# EAGLE design Lab05 (EAGLE 9.6.2)
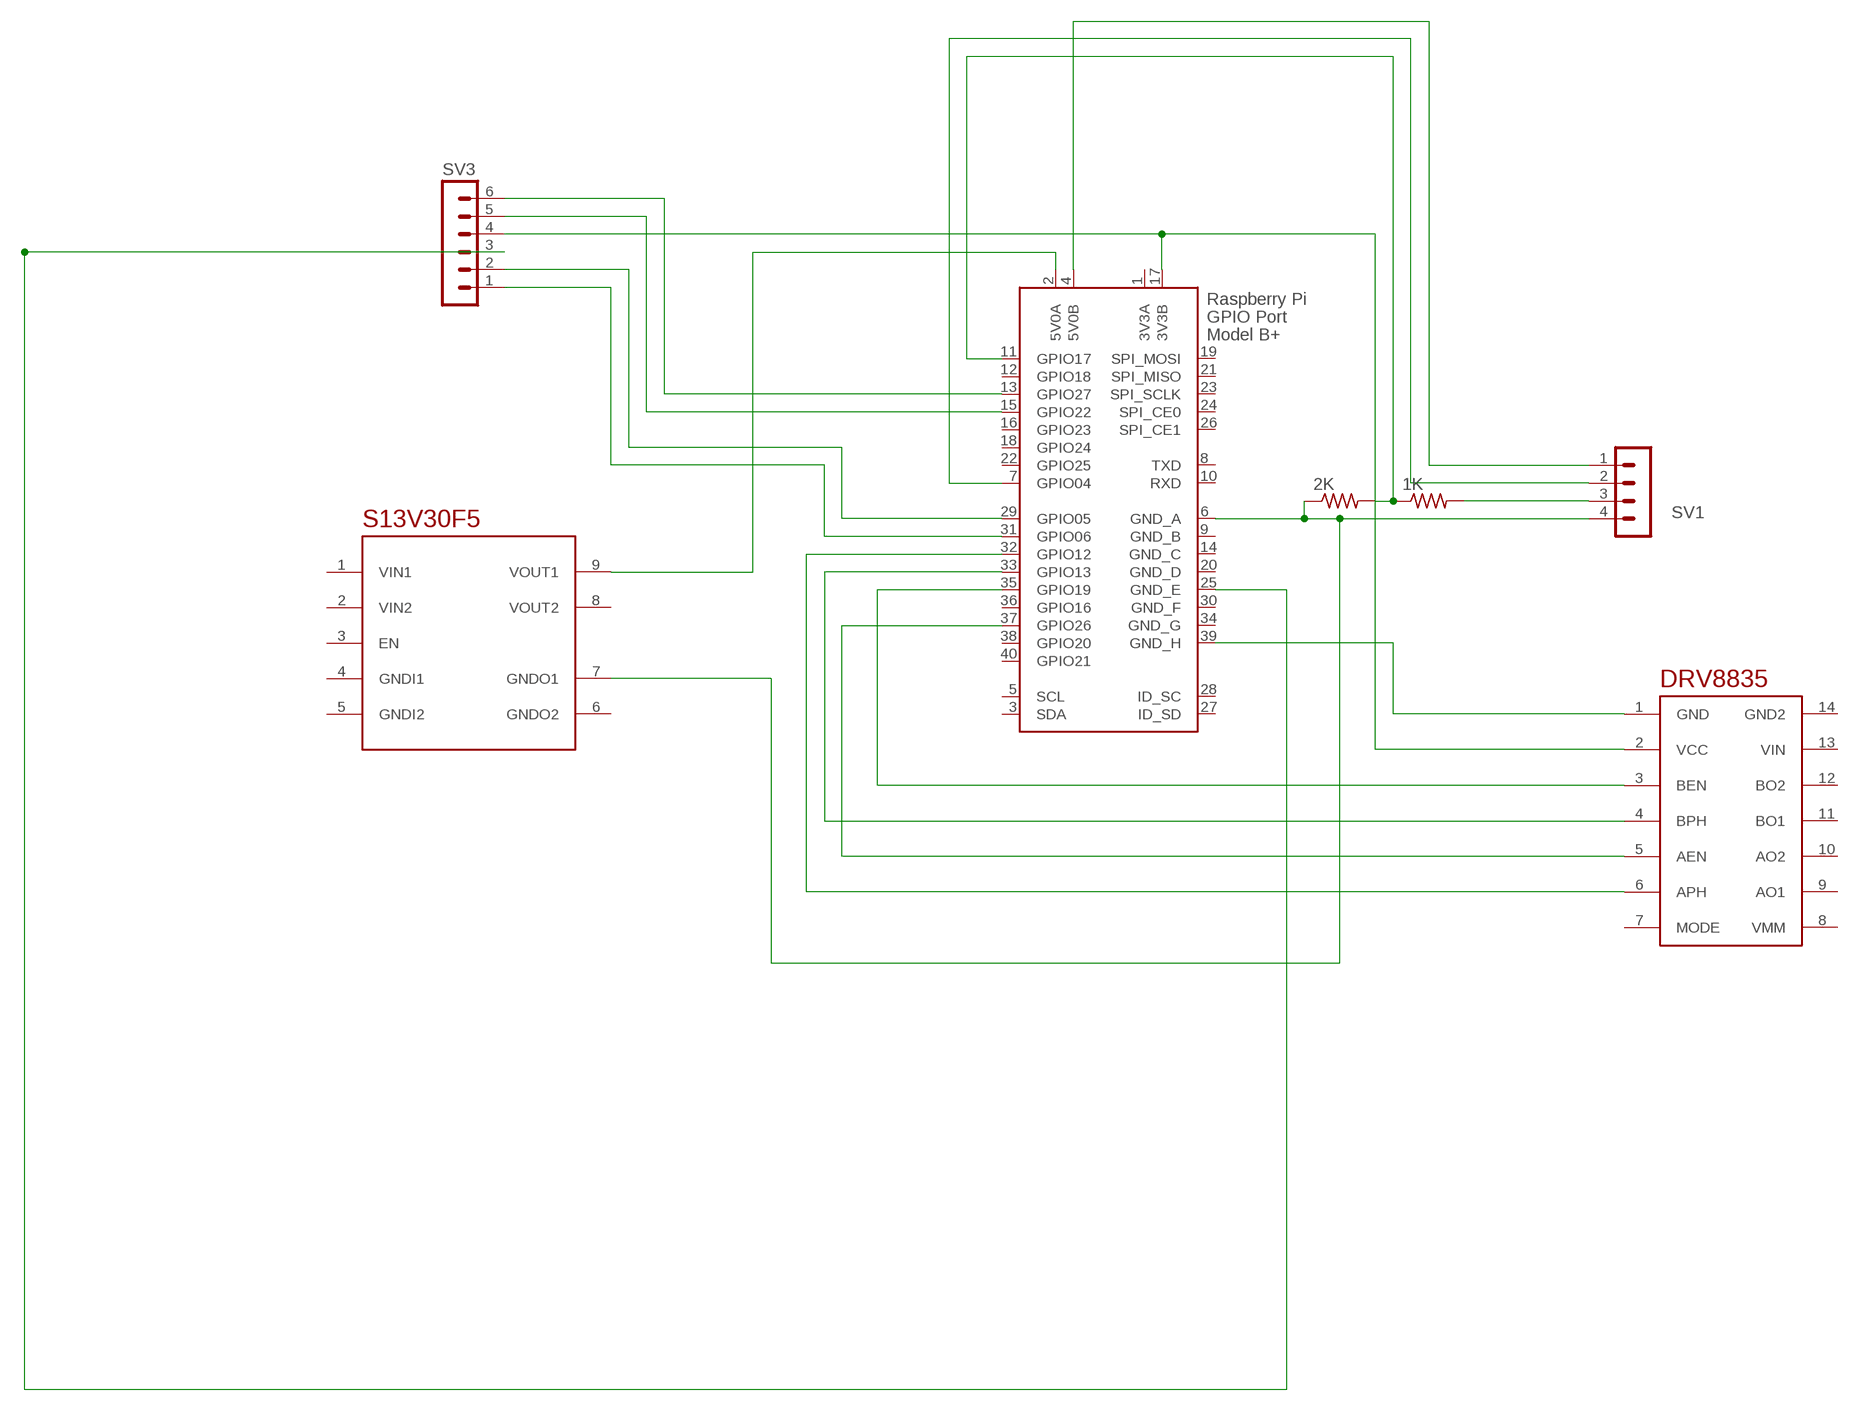
[diagram p0: schematic, sheet 1]

## Parts
1K  R-US_0207/10  [0207/10]
2K  R-US_0207/10  [0207/10]
SV1  MA04-1  [MA04-1]
SV3  MA06-1  [MA06-1]
U$1  DRV8835  [DRV8835]
U$2  S13V20F5  [S13V20F5]
X1  RASPI_BOARD_B+#_E4  [RASPI_BOARD_B+_EDGES_4DRILL]

## Nets
N$1: SV1.1 X1.4(5V0B)
N$2: SV1.2 X1.7(GPIO04)
N$3: 1K.2 SV1.3
N$4: 1K.1 2K.2 X1.11(GPIO17)
N$5: 2K.1 SV1.4 U$2.7(GNDO1) X1.6(GND_A)
N$6: SV3.4 U$1.2(VCC) X1.17(3V3B)
N$7: SV3.6 X1.13(GPIO27)
N$8: SV3.5 X1.15(GPIO22)
N$9: SV3.2 X1.29(GPIO05)
N$10: SV3.1 X1.31(GPIO06)
N$11: SV3.3 X1.25(GND_E)
N$12: U$1.4(BPH) X1.33(GPIO13)
N$13: U$1.6(APH) X1.32(GPIO12)
N$14: U$1.5(AEN) X1.37(GPIO26)
N$15: U$1.3(BEN) X1.35(GPIO19)
N$16: U$1.1(GND) X1.39(GND_H)
N$17: U$2.9(VOUT1) X1.2(5V0A)
Unconnected: U$1.7(MODE) U$1.8(VMM) U$1.9(AO1) U$1.10(AO2) U$1.11(BO1) U$1.12(BO2) U$1.13(VIN) U$1.14(GND2) U$2.1(VIN1) U$2.2(VIN2) U$2.3(EN) U$2.4(GNDI1) U$2.5(GNDI2) U$2.6(GNDO2) U$2.8(VOUT2) X1.3(SDA) X1.5(SCL) X1.8(TXD) X1.10(RXD) X1.12(GPIO18) X1.16(GPIO23) X1.18(GPIO24) X1.19(SPI_MOSI) X1.21(SPI_MISO) X1.22(GPIO25) X1.23(SPI_SCLK) X1.24(SPI_CE0) X1.26(SPI_CE1) X1.27(ID_SD) X1.28(ID_SC) X1.36(GPIO16) X1.38(GPIO20) X1.40(GPIO21)

## Power pins joined to a net without a drawn wire
3V3A: X1.1(3V3A)
GND_B: X1.9(GND_B)
GND_C: X1.14(GND_C)
GND_D: X1.20(GND_D)
GND_F: X1.30(GND_F)
GND_G: X1.34(GND_G)

## Library data of the parts
1K 2K = rcl:R-US_: RESISTOR, American symbol; SPICEPREFIX: R
SV1 = con-lstb:MA04-1: PIN HEADER; OC_FARNELL: unknown; OC_NEWARK: unknown
SV3 = con-lstb:MA06-1: PIN HEADER; OC_FARNELL: unknown; OC_NEWARK: unknown
U$1 = mt280_21:DRV8835
U$2 = mt280_21:S13V20F5
X1 = raspberrypi_bastelstube_v13:RASPI_BOARD_B+#: Raspberry Pi GPIO connector with markings for the outer dimensions of the Raspberry Pi board model B+ with different sets of drill holes or mounting pads All pins connected

## Board
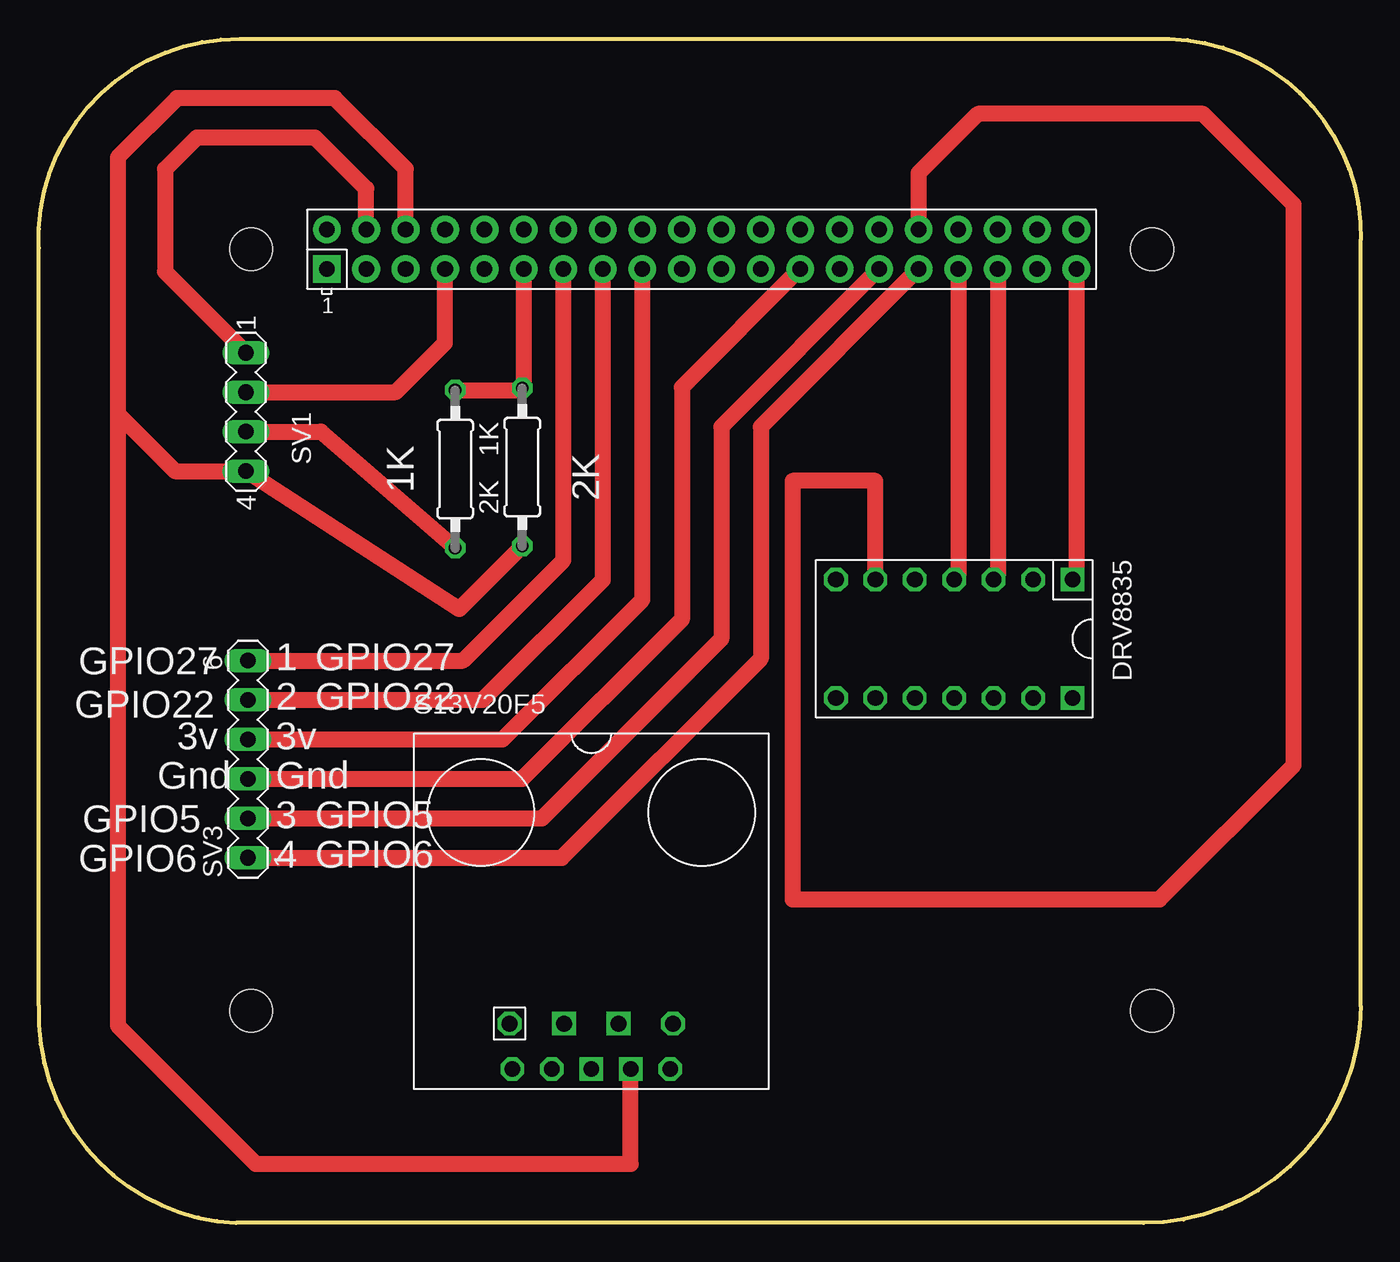
[diagram p1: board, top side]
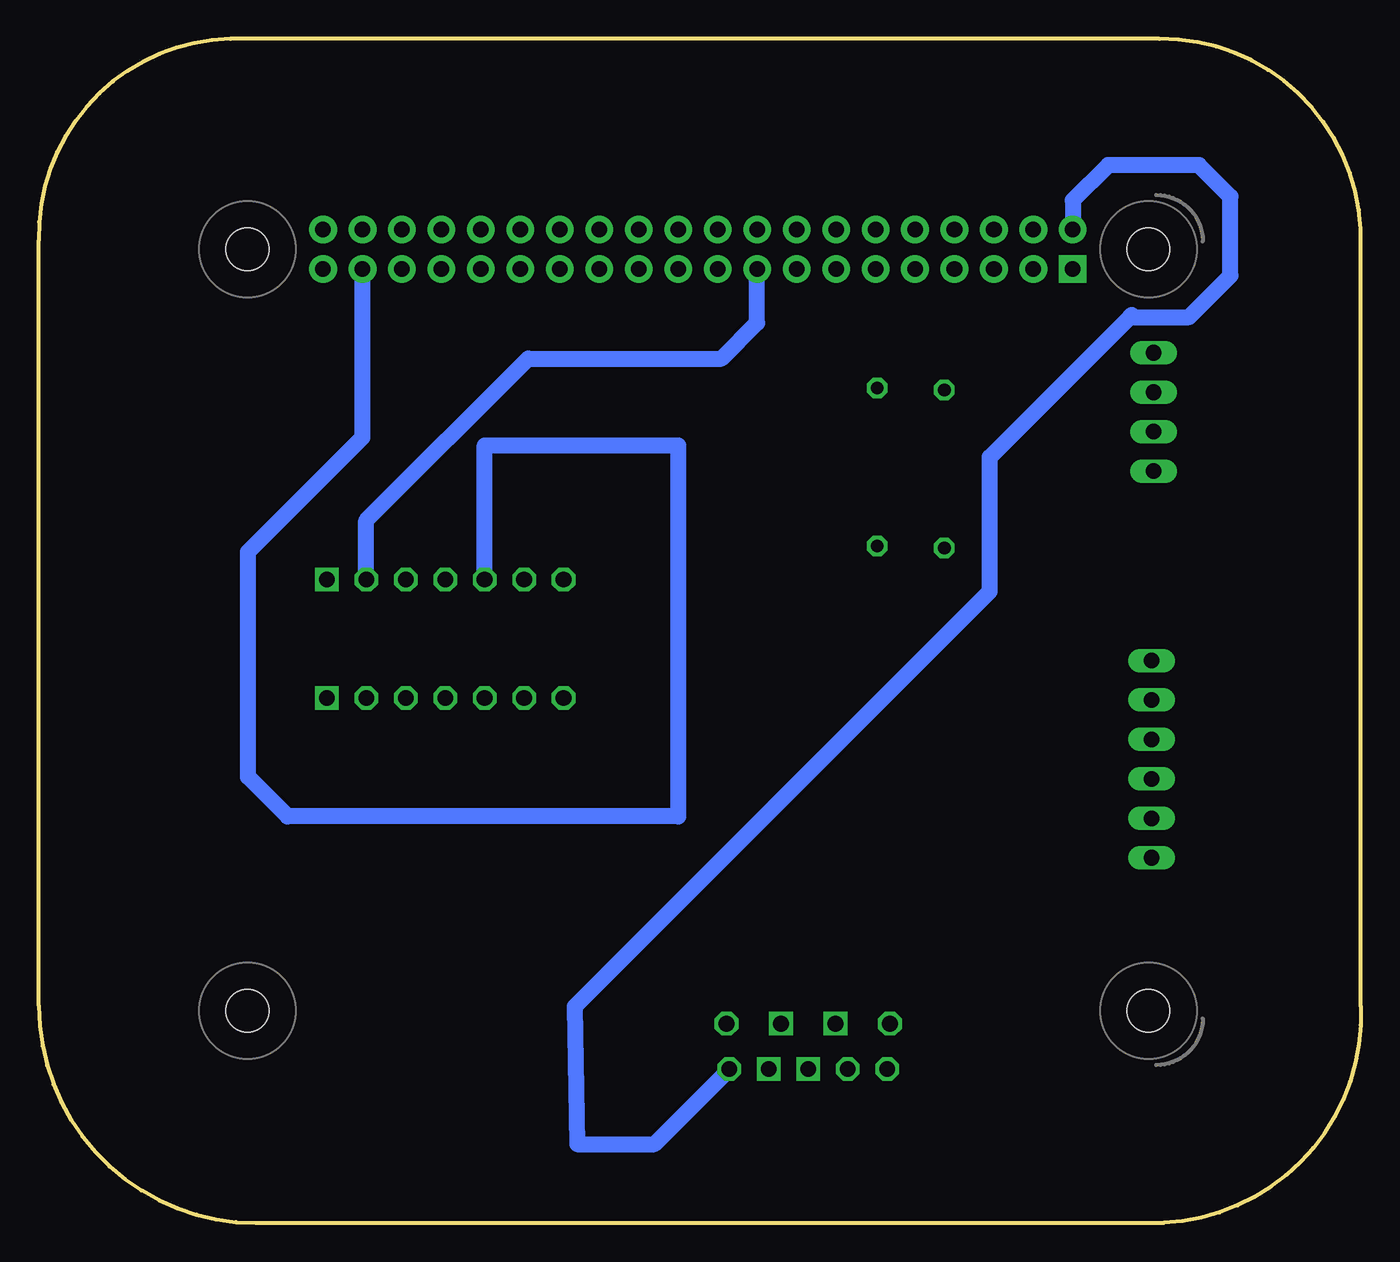
[diagram p2: board, bottom side, seen from below]

Size 85.09 x 76.2 mm. Coordinates in mm from the lower left corner, seen from the top.
Outline: 0,13.97 arc90 12.7,0 71.12,0 arc90 85.09,13.97 85.09,63.25 arc90 72.77,76.2 12.96,76.2 arc93 0,62.74 0,13.97
Copper layers (1*16): Top 0.035mm / dielectric 1.5mm / Bottom 0.035mm
Design rules "default": minimum track width 6mil, minimum drill 0.35mm, track to track 6mil, track to pad 6mil, pad to pad 6mil, via to via 6mil, smd to smd 6mil, copper to edge 40mil, drill to drill 6mil, minimum pad ring 10mil, minimum via ring 8mil, stop-mask expansion 4mil, vias tented up to drill 0mil, thermal gap 10mil

### Footprints (pad centres in the part's own frame; a part is rotated, then mirrored left to right if it is on the bottom)
0207/10 = drill 0.813 octagon: 1 -5.08,0; 2 5.08,0
MA04-1 = drill 1.016 long: 1 -3.81,0; 2 -1.27,0; 3 1.27,0; 4 3.81,0
MA06-1 = drill 1.016 long: 1 -6.35,0; 2 -3.81,0; 3 -1.27,0; 4 1.27,0; 5 3.81,0; 6 6.35,0
DRV8835 = drill 1.016 square: 1 -3.81,7.62; 14 3.81,7.62 | drill 1.016 octagon: 2 -3.81,5.08; 3 -3.81,2.54; 4 -3.81,0; 5 -3.81,-2.54; 6 -3.81,-5.08; 7 -3.81,-7.62; 8 3.81,-7.62; 9 3.81,-5.08; 10 3.81,-2.54; 11 3.81,0; 12 3.81,2.54; 13 3.81,5.08
S13V20F5 = drill 1.016 octagon: 1 -5.258,-7.239; 2 -2.54,-10.16; 3 -5.08,-10.16; 8 5.258,-7.239; 9 5.08,-10.16 | drill 1.016 square: 4 -1.753,-7.239; 5 0,-10.16; 6 1.753,-7.239; 7 2.54,-10.16
RASPI_BOARD_B+_EDGES_4DRILL = drill 1 pad 1.778 square: 1 8.37,51.23 | drill 1 pad 1.778: 2 8.37,53.77; 3 10.91,51.23; 4 10.91,53.77; 5 13.45,51.23; 6 13.45,53.77; 7 15.99,51.23; 8 15.99,53.77; 9 18.53,51.23; 10 18.53,53.77; 11 21.07,51.23; 12 21.07,53.77; 13 23.61,51.23; 14 23.61,53.77; 15 26.15,51.23; 16 26.15,53.77; 17 28.69,51.23; 18 28.69,53.77; 19 31.23,51.23; 20 31.23,53.77; 21 33.77,51.23; 22 33.77,53.77; 23 36.31,51.23; 24 36.31,53.77; 25 38.85,51.23; 26 38.85,53.77; 27 41.39,51.23; 28 41.39,53.77; 29 43.93,51.23; 30 43.93,53.77; 31 46.47,51.23; 32 46.47,53.77; 33 49.01,51.23; 34 49.01,53.77; 35 51.55,51.23; 36 51.55,53.77; 37 54.09,51.23; 38 54.09,53.77; 39 56.63,51.23; 40 56.63,53.77 | hole 2.75: 3.5,3.5; 3.5,52.5; 61.5,3.5; 61.5,52.5

### Placement (x,y rotation side)
1K  26.8,48.51 270 top
2K  31.12,48.64 90 top
SV1  13.34,52.2 270 top
SV3  13.46,29.84 90 top
U$1  58.93,37.59 270 top
U$2  35.56,20.07 0 top
X1  10.16,10.16 0 top

### Tracks (layer width: path | path; a pad name or v marks a point on that pad's centre or on a via)
N$1
  Top 1.016: X1.4 21.07,66.56 17.78,69.85 10.16,69.85 8.13,67.82 8.13,61.21 SV1.1
N$2
  Top 1.016: X1.7 26.15,56.64 22.98,53.47 SV1.2
N$3
  Top 1.016: 1K.2 18.15,50.93 SV1.3
N$4
  Top 1.016: 1K.1 30.99,53.59 2K.2 31.23,53.84 X1.11
N$5
  Top 1.016: 2K.1 27.05,39.5 SV1.4 8.76,48.39 5.08,52.07 | X1.6 23.61,67.83 19.05,72.39 8.89,72.39 5.08,68.58 5.08,52.07 | 5.08,52.07 5.08,12.7 13.97,3.81 38.1,3.81 U$2.7
N$6
  Top 1.016: SV3.4 29.85,31.11 38.85,40.12 X1.17
  Bottom 1.016: U$1.2 64.01,45.21 53.6,55.63 41.15,55.63 38.85,57.92 X1.17
N$7
  Top 1.016: SV3.6 27.31,36.2 33.77,42.66 X1.13
N$8
  Top 1.016: SV3.5 28.58,33.66 36.31,41.39 X1.15
N$9
  Top 1.016: SV3.2 32.39,26.04 43.93,37.58 43.93,51.23 X1.29
N$10
  Top 1.016: SV3.1 33.66,23.5 46.47,36.31 46.47,51.23 X1.31
N$11
  Top 1.016: SV3.3 31.12,28.57 41.39,38.85 41.39,53.77 X1.25
N$12
  Top 1.016: U$1.4 59.18,41.66 59.18,61.38 X1.33
N$13
  Top 1.016: U$1.6 53.85,47.75 48.52,47.75 48.52,20.83 72.14,20.83 80.77,29.46 80.77,65.53 74.93,71.37 60.45,71.37 56.63,67.55 X1.32
N$14
  Bottom 1.016: U$1.5 56.39,50.04 43.94,50.04 43.94,26.16 69.09,26.16 71.63,28.7 71.63,43.18 64.25,50.56 X1.37
N$15
  Top 1.016: U$1.3 61.72,41.66 61.72,61.38 X1.35
N$16
  Top 1.016: X1.39 66.79,41.64 U$1.1
N$17
  Bottom 1.016: U$2.9 45.47,5.08 50.44,5.08 50.6,13.92 23.88,40.64 23.88,49.28 14.86,58.29 | 14.86,58.29 14.73,58.42 | 14.86,58.29 11.05,58.29 8.38,60.96 8.38,66.04 10.42,68.07 16.26,68.07 18.53,65.8 X1.2

### Text on the board
tPlace: 2K | 1K | 1 | GPIO27 | GPIO27 | GPIO22 | 2 | GPIO22 | 3v | 3v | Gnd | Gnd | GPIO5 | 3 | GPIO5 | GPIO6 | 4 | GPIO6